# Altium schematic sheet keypad_schematic.SchDoc
size B; SheetNumber: 1; SheetTotal: 1
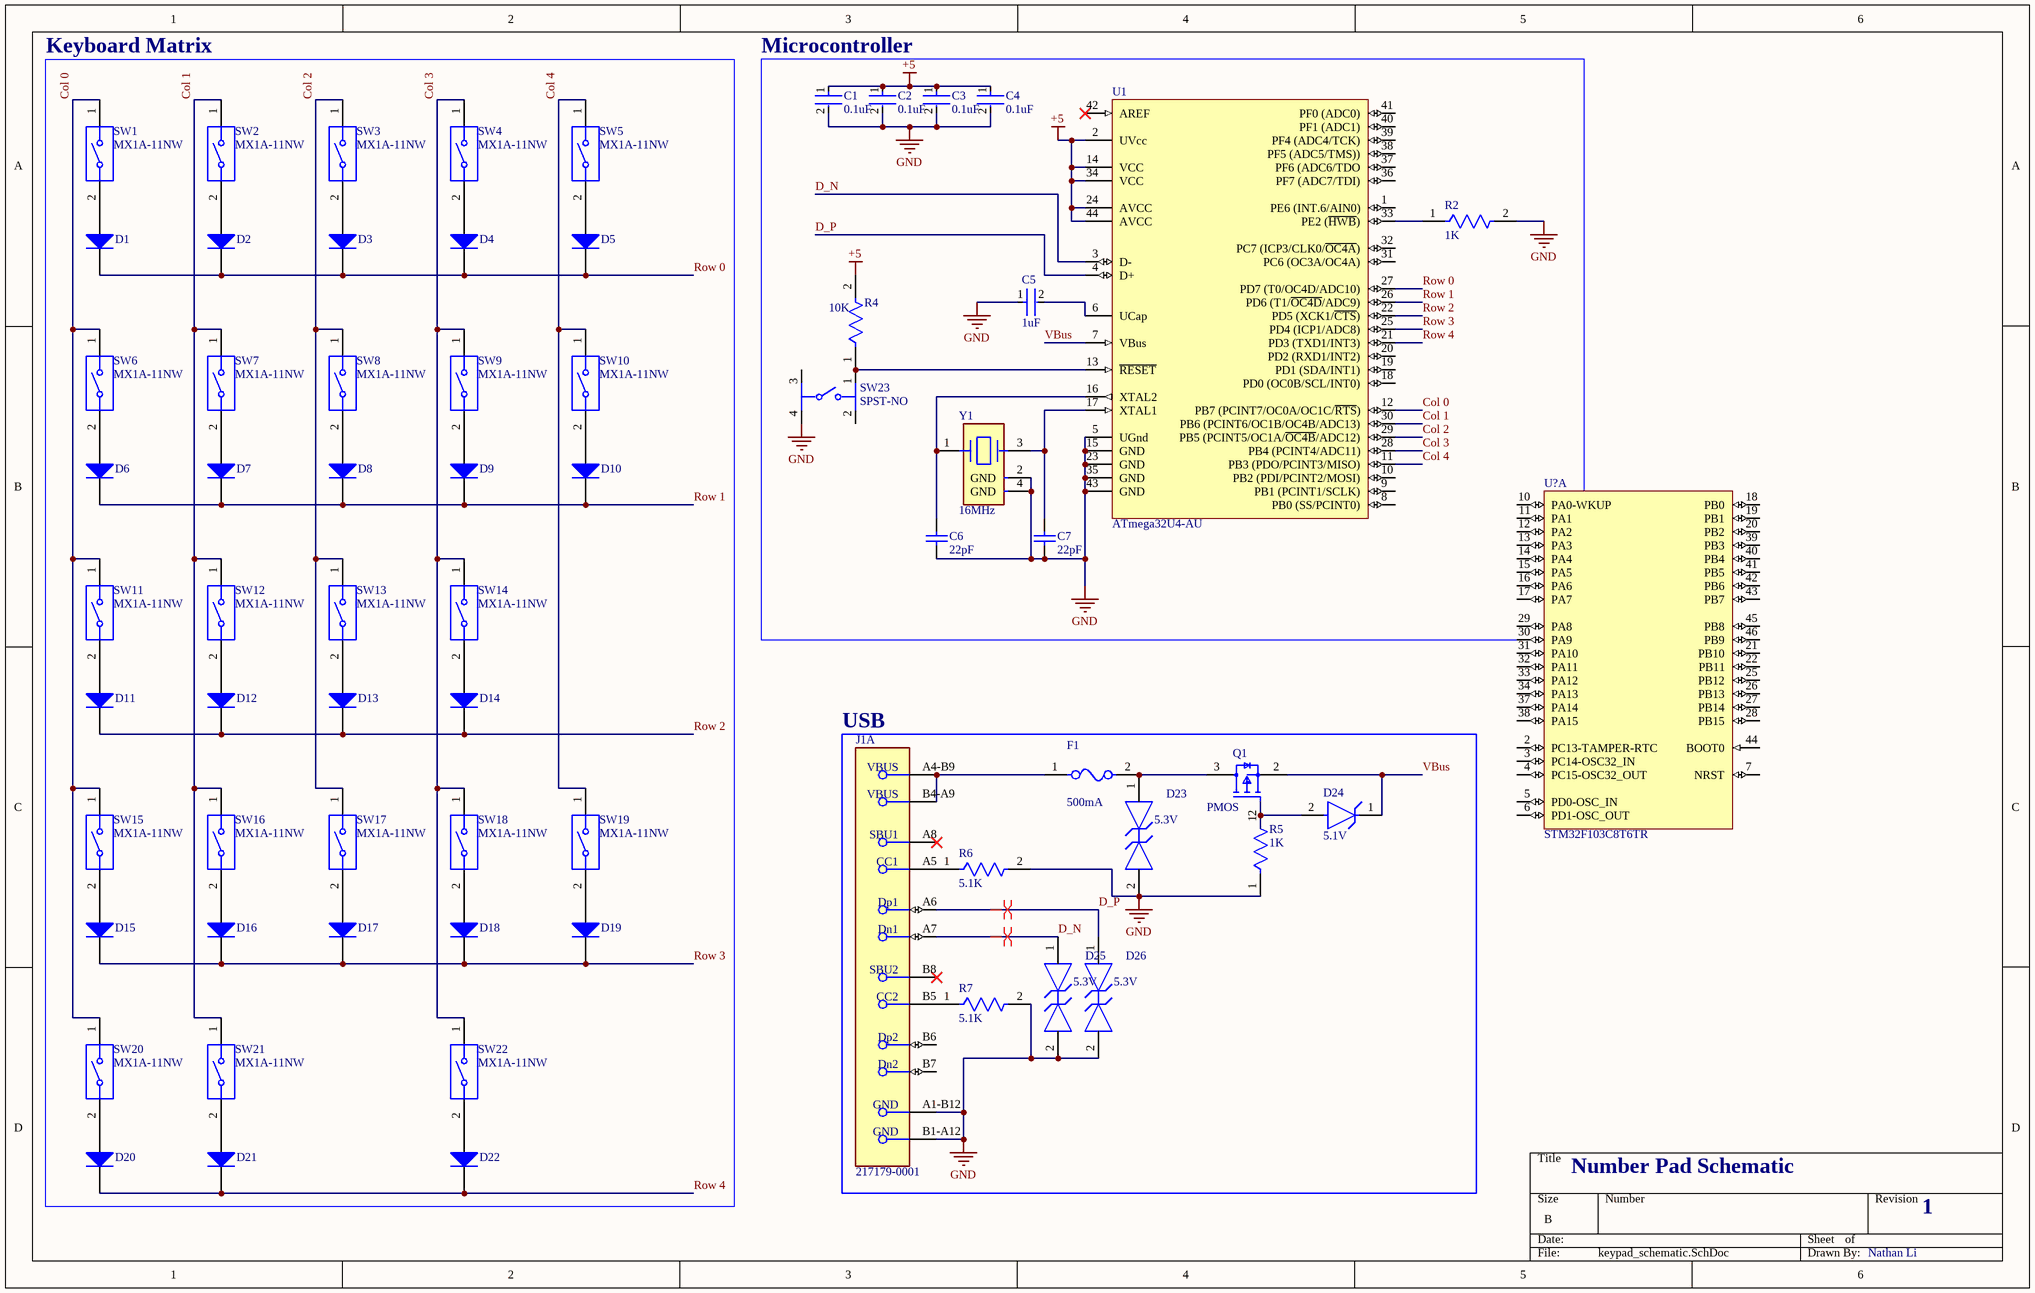
[diagram p0: keypad_schematic.SchDoc]

## Parts
C1  0.1uF  [FP-CL278-IPC_C]
C2  0.1uF  [FP-CL278-IPC_C]
C3  0.1uF  [FP-CL278-IPC_C]
C4  0.1uF  [FP-CL278-IPC_C]
C5  1uF  [FP-CL1016-IPC_C]
C6  22pF  [CAPC1005X55X25NL05T10]
C7  22pF  [CAPC1005X55X25NL05T10]
D1  (no value)  [DIOD-SOD123-2_V]
D2  (no value)  [DIOD-SOD123-2_V]
D3  (no value)  [DIOD-SOD123-2_V]
D4  (no value)  [DIOD-SOD123-2_V]
D5  (no value)  [DIOD-SOD123-2_V]
D6  (no value)  [DIOD-SOD123-2_V]
D7  (no value)  [DIOD-SOD123-2_V]
D8  (no value)  [DIOD-SOD123-2_V]
D9  (no value)  [DIOD-SOD123-2_V]
D10  (no value)  [DIOD-SOD123-2_V]
D11  (no value)  [DIOD-SOD123-2_V]
D12  (no value)  [DIOD-SOD123-2_V]
D13  (no value)  [DIOD-SOD123-2_V]
D14  (no value)  [DIOD-SOD123-2_V]
D15  (no value)  [DIOD-SOD123-2_V]
D16  (no value)  [DIOD-SOD123-2_V]
D17  (no value)  [DIOD-SOD123-2_V]
D18  (no value)  [DIOD-SOD123-2_V]
D19  (no value)  [DIOD-SOD123-2_V]
D20  (no value)  [DIOD-SOD123-2_V]
D21  (no value)  [DIOD-SOD123-2_V]
D22  (no value)  [DIOD-SOD123-2_V]
D23  5.3V  [FP-714AB-MFG]
D24  5.1V  [FP-SOD123-MFG]
D25  5.3V  [FP-714AB-MFG]
D26  5.3V  [FP-714AB-MFG]
F1  500mA  [FP-SF-1206S-MFG]
J1  217179-0001  [FP-2171790001-MFG]  (part A of 2)
Q1  PMOS  [FP-SOT23-MFG]
R2  1K  [FP-RMCF0603-MFG]
R4  10K  [FP-RMCF0603-MFG]
R5  1K  [FP-RMCF0603-MFG]
R6  5.1K  [FP-RG1608-IPC_C]
R7  5.1K  [FP-RG1608-IPC_C]
SW1  MX1A-11NW  [CHRY-MX1A-11NW_V]
SW2  MX1A-11NW  [CHRY-MX1A-11NW_V]
SW3  MX1A-11NW  [CHRY-MX1A-11NW_V]
SW4  MX1A-11NW  [CHRY-MX1A-11NW_V]
SW5  MX1A-11NW  [CHRY-MX1A-11NW_V]
SW6  MX1A-11NW  [CHRY-MX1A-11NW_V]
SW7  MX1A-11NW  [CHRY-MX1A-11NW_V]
SW8  MX1A-11NW  [CHRY-MX1A-11NW_V]
SW9  MX1A-11NW  [CHRY-MX1A-11NW_V]
SW10  MX1A-11NW  [CHRY-MX1A-11NW_V]
SW11  MX1A-11NW  [CHRY-MX1A-11NW_V]
SW12  MX1A-11NW  [CHRY-MX1A-11NW_V]
SW13  MX1A-11NW  [CHRY-MX1A-11NW_V]
SW14  MX1A-11NW  [CHRY-MX1A-11NW_V]
SW15  MX1A-11NW  [CHRY-MX1A-11NW_V]
SW16  MX1A-11NW  [CHRY-MX1A-11NW_V]
SW17  MX1A-11NW  [CHRY-MX1A-11NW_V]
SW18  MX1A-11NW  [CHRY-MX1A-11NW_V]
SW19  MX1A-11NW  [CHRY-MX1A-11NW_V]
SW20  MX1A-11NW  [CHRY-MX1A-11NW_V]
SW21  MX1A-11NW  [CHRY-MX1A-11NW_V]
SW22  MX1A-11NW  [CHRY-MX1A-11NW_V]
SW23  SPST-NO  [FP-PTS647SK38SMTR2LFS-MFG]
U1  ATmega32U4-AU  [44ML_M]
U?  STM32F103C8T6TR  [STM-LQFP48_M]  (part A of 2)
Y1  16MHz  [FP-TSX-3225-MFG]

## Blocks framed on the sheet
Keyboard Matrix: D1-D22 SW1-SW22
Microcontroller: C1-C7 R2 R4 SW23 U1 Y1
USB: D23-D26 F1 J1 Q1 R5-R7

## Nets
+5: C1.1 C2.1 C3.1 C4.1 R4.2 U1.2(UVcc) U1.14(VCC) U1.24(AVCC) U1.34(VCC) U1.44(AVCC)
GND: C1.2 C2.2 C3.2 C4.2 C5.1 C6.1 C7.1 D23.2 D25.2 D26.2 J1.A1-B12(GND) J1.B1-A12(GND) R2.2 R5.1 R6.2 R7.2 SW23.4 U1.5(UGnd) U1.15(GND) U1.23(GND) U1.35(GND) U1.43(GND) Y1.2(GND) Y1.4(GND)
Col 0: SW1.1 SW6.1 SW11.1 SW15.1 SW20.1 U1.12(PB7_(PCINT7/OC0A/OC1C/~{RTS}))
Col 1: SW2.1 SW7.1 SW12.1 SW16.1 SW21.1 U1.30(PB6_(PCINT6/OC1B/OC4B/ADC13))
Col 2: SW3.1 SW8.1 SW13.1 SW17.1 U1.29(PB5_(PCINT5/OC1A/~{OC4B}/ADC12))
Col 3: SW4.1 SW9.1 SW14.1 SW18.1 SW22.1 U1.28(PB4_(PCINT4/ADC11))
Col 4: SW5.1 SW10.1 SW19.1 U1.11(PB3_(PDO/PCINT3/MISO))
D_N: D25.1 J1.A7(Dn1) U1.3(D-)
D_P: D26.1 J1.A6(Dp1) U1.4(D+)
Row 0: D1.2(K) D2.2(K) D3.2(K) D4.2(K) D5.2(K) U1.27(PD7_(T0/OC4D/ADC10))
Row 1: D6.2(K) D7.2(K) D8.2(K) D9.2(K) D10.2(K) U1.26(PD6_(T1/~{OC4D}/ADC9))
Row 2: D11.2(K) D12.2(K) D13.2(K) D14.2(K) U1.22(PD5_(XCK1/~{CTS}))
Row 3: D15.2(K) D16.2(K) D17.2(K) D18.2(K) D19.2(K) U1.25(PD4_(ICP1/ADC8))
Row 4: D20.2(K) D21.2(K) D22.2(K) U1.21(PD3_(TXD1/INT3))
VBus: D24.1(C) Q1.2(S) U1.7(VBus)
NetC5_2: C5.2 U1.6(UCap)
NetC6_2: C6.2 U1.16(XTAL2) Y1.1
NetC7_2: C7.2 U1.17(XTAL1) Y1.3
NetD1_1: D1.1(A) SW1.2
NetD2_1: D2.1(A) SW2.2
NetD3_1: D3.1(A) SW3.2
NetD4_1: D4.1(A) SW4.2
NetD5_1: D5.1(A) SW5.2
NetD6_1: D6.1(A) SW6.2
NetD7_1: D7.1(A) SW7.2
NetD8_1: D8.1(A) SW8.2
NetD9_1: D9.1(A) SW9.2
NetD10_1: D10.1(A) SW10.2
NetD11_1: D11.1(A) SW11.2
NetD12_1: D12.1(A) SW12.2
NetD13_1: D13.1(A) SW13.2
NetD14_1: D14.1(A) SW14.2
NetD15_1: D15.1(A) SW15.2
NetD16_1: D16.1(A) SW16.2
NetD17_1: D17.1(A) SW17.2
NetD18_1: D18.1(A) SW18.2
NetD19_1: D19.1(A) SW19.2
NetD20_1: D20.1(A) SW20.2
NetD21_1: D21.1(A) SW21.2
NetD22_1: D22.1(A) SW22.2
NetD23_1: D23.1 F1.2 Q1.3(D)
NetD24_2: D24.2(A) Q1.1(G) R5.2
NetF1_1: F1.1 J1.A4-B9(VBUS) J1.B4-A9(VBUS)
NetJ1_A5: J1.A5(CC1) R6.1
NetJ1_B5: J1.B5(CC2) R7.1
NetR2_1: R2.1 U1.33(PE2_(~{HWB}))
NetR4_1: R4.1 SW23.1 U1.13(~{RESET})

Not connected (* = marked no-connect by the designer): J1 A8(SBU1)* B6(Dp2) B7(Dn2) B8(SBU2)*; SW23 2 3; U1 1(PE6_(INT.6/AIN0)) 8(PB0_(SS/PCINT0)) 9(PB1_(PCINT1/SCLK)) 10(PB2_(PDI/PCINT2/MOSI)) 18(PD0_(OC0B/SCL/INT0)) 19(PD1_(SDA/INT1)) 20(PD2_(RXD1/INT2)) 31(PC6_(OC3A/OC4A)) 32(PC7_(ICP3/CLK0/~{OC4A})) 36(PF7_(ADC7/TDI)) 37(PF6_(ADC6/TDO) 38(PF5_(ADC5/TMS))) 39(PF4_(ADC4/TCK)) 40(PF1_(ADC1)) 41(PF0_(ADC0)) 42(AREF)*; U? 2(PC13-TAMPER-RTC) 3(PC14-OSC32_IN) 4(PC15-OSC32_OUT) 5(PD0-OSC_IN) 6(PD1-OSC_OUT) 7(NRST) 10(PA0-WKUP) 11(PA1) 12(PA2) 13(PA3) 14(PA4) 15(PA5) 16(PA6) 17(PA7) 18(PB0) 19(PB1) 20(PB2) 21(PB10) 22(PB11) 25(PB12) 26(PB13) 27(PB14) 28(PB15) 29(PA8) 30(PA9) 31(PA10) 32(PA11) 33(PA12) 34(PA13) 37(PA14) 38(PA15) 39(PB3) 40(PB4) 41(PB5) 42(PB6) 43(PB7) 44(BOOT0) 45(PB8) 46(PB9)

## Layout directives
differential pair: D_N, D_P

## Notes on the sheet
- Number Pad Schematic
- 1
- Nathan Li

## Library data of the parts
C1-C4 = CMP-13271-000728-1: Cap Ceramic 100nF 25V X5R ±10% SMD 0402 +85°C Paper T/R; Package Quantity: 1; Height: 0.5mm; Case Code (Metric): 1005; Thickness: 0.022inch; Mount: Surface Mount; Lead Free: Lead Free; Case Code (Imperial): 0402; Packaging: Tape and Reel; Depth: 0.5mm; Voltage: 25V; Min Operating Temperature: -55°C; Voltage Rating: 25V; Dielectric: X5R; Case/Package: 0402; Tolerance: 10%; Width: 0.02inch; Max Operating Temperature: 85°C; Capacitance: 100nF; Length: 1mm; Radiation Hardening: No; Voltage Rating (DC): 25V
C5 = CMP-13271-001946-1: Cap Ceramic 1uF 6.3V X5R ±10% SMD 0402 +85°C Paper T/R; Radiation Hardening: No; Thickness: 0.022inch; Length: 1mm; Voltage Rating: 6.3V; Case Code (Metric): 1005; Voltage: 6.3V; Capacitance: 1uF; Depth: 0.5mm; Min Operating Temperature: -55°C; Height: 0.5mm; Mount: Surface Mount; Case/Package: 0402; Material: Ceramic; Case Code (Imperial): 0402; Lead Free: Lead Free; Width: 0.02inch; Max Operating Temperature: 85°C; Voltage Rating (DC): 6.3V; Tolerance: 10%; Dielectric: X5R; Packaging: Tape and Reel
C6 C7 = CMP-2008-04302-1: Part Number: GRM1555C1H220JA01D; Manufacturer: Murata
D1-D22 = CMP-2000-04932-2: Fast Switching Diode, 100 V, 0.15 A, -65 to 150 degC, 2-Pin?SOD123, RoHS, Tape and Reel; Recovery Time: 4ns; Brand: DiodesIncorporated; Unit Weight: 0.000353oz; Max Surge Current: 2A; Peak Reverse Voltage: 100V; Ir - Reverse Current: 1uA; Vf - Forward Voltage: 1.25V; Configuration: Single; If - Forward Current: 0.15A; Product Category: Diodes-GeneralPurpose,Power,Switching; Operating Temperature Range: -65Cto+150C; Packaging: Reel; Manufacturer URL: http://www.diodes.com/; Maximum Operating Temperature: +150C; Height: 1.25mm; Minimum Operating Temperature: -65C; Product: SwitchingDiodes; Package URL: http://www.diodes.com/datasheets/ds18004.pdf; Type: SwitchingDiode; Package Reference: SOD123-2; Width: 1.7mm; Datasheet URL: http://www.farnell.com/datasheets/1915529.pdf; Datasheet Version: Rev. 24-2, 10/2013; Series: 1N4148; Factory Pack Quantity: 3000; Length: 2.85mm; RoHS: True; Manufacturer: DiodesIncorporated; Mounting Style: SMD/SMT; Package / Case: SOD-123
D23 D25 D26 = CMP-00278-76731233-1: ESD7571N2T5G Esd Protection Device, 5.3V, 0.3W, X2Dfn Rohs Compliant: Yes; Manufacturer Lifecycle Status: ACTIVE; Number of Channels: 1; RoHS: Compliant; NexarPartId: 76731233; Lifecycle Status: Production
D24 = CMP-12792-000005-1: DIODE ZENER 5.1V 500MW SOD123; Manufacturer: Diodes; Manufacturer Part Number: MMSZ5231B-7-F; Standoff Height: 0mm; Max Zener Voltage: 5.36V; Max Reverse Leakage Current: 5uA; Max Junction Temp: +150°C; Power Dissipation: 370mW; Zener Impedance: 17Ω; Temperature: -65°C to +150°C; RoHS: TRUE; ComponentLink2Description: Datasheet; Octopart: https://octopart.com/mmsz5231b-7-f-diodes+inc.-55400050; Height: 1.45mm; ComponentLink2URL: https://www.diodes.com/assets/Datasheets/ds18010.pdf; Footprint Url: https://www.diodes.com/assets/Package-Files/SOD123.pdf; Device Class L2: Diodes; Nom Zener Voltage: 5.1V; Temperature Range Low: -65°C; Mouser Description: Zener Diodes 5.1V 500mW; Digikey Description: DIODE ZENER 5.1V 500MW SOD123; Device Class L1: Discrete Semiconductors; Device Class L3: Zener Diodes; Lead Free: Yes; Category: Diode; Automotive: No; Package: SOD123; Temperature Range High: +150°C
F1 = CMP-07399-000002-1: FUSE BOARD MNT 500MA 63VDC 1206; Manufacturer: Bourns; Manufacturer Part Number: SF-1206S050-2; Fuse Blow Speed: Slow; Voltage Rating: 63V; Value: 596mΩ; Fuse Interrupt Dc Current: 50A; Fuse I2T: 0.03A2Sec; Fuse Current: 0.5A; Digikey Description: FUSE BOARD MNT 500MA 63VDC 1206; ComponentLink2Description: Datasheet; Temperature: -20°C to +105°C; Category: Fuse; Device Class L2: Fuses; Device Class L3: unset; ComponentLink2URL: https://www.bourns.com/docs/product-datasheets/sf-1206s.pdf?sfvrsn=e6b376e3_33; RoHS: TRUE; Package: SF-1206S; Height: 0.7mm; Octopart: https://octopart.com/sf-1206s050-2-bourns-8398336; Ipc Land Pattern Name: CAPC310155X60; Temperature Range Low: -20°C; Lead Free: Yes; Max Fuse Dc Voltage: 63V; Automotive: No; Device Class L1: Circuit Protection; Mouser Description: Fuse Chip Slow Blow Acting 0.5A 63V SMD Solder Pad 1206 T/R UL; Resistance: 596mΩ; Temperature Range High: +105°C
J1 = CMP-04767-000028-2: CONN RCP USB2.0 TYP C 24P SMD RA; NexarPartId: 117190526; Gender: Receptacle; Number of Contacts: 16; Current Rating: 1.25A; Voltage Rating: 30V; Min Operating Temperature: -40°C; USB Standard: USB 2.0; Height: 3.36mm; Contact Material: Gold, Nickel; Max Operating Temperature: 85°C
Q1 = CMP-12801-000021-1: MOSFET P-CH 20V 4.2A SOT23; Manufacturer: Diodes Inc.; Manufacturer Part Number: DMG2305UX-13; Input Capacitace At Vds: 808pF @ -15V; Rthja Max: 90°C/W; Drain To Source Voltage: -20V; Standoff Height: 0.013mm; Number Of P Channels: 1; Gate To Source Voltage: 8V; Turn On Delay Time: 10.8ns; Pulse Drain Current: -15A; Threshold Vgs Max: -0.9V; Max Junction Temp: +150°C; Depletion Mode: False; Drain To Source Resistance: 40mΩ; Threshold Vgs Min: -0.5V; Continuous Drain Current: -4.2A; Turn Off Delay Time: 79.3ns; Gate Charge At Vgs: 10.2nC @ -4.5V; Power Dissipation: 1.4W; Digikey Description: MOSFET P-CH 20V 4.2A SOT23; Temperature Range High: +150°C; Height: 1.1mm; Package: SOT23; Footprint Url: https://www.diodes.com/assets/Package-Files/SOT23.pdf; Device Class L3: MOSFETs; RoHS: TRUE; Temperature: -55°C to +150°C; Mouser Description: MOSFET P-Ch ENH FET -20V 52mOhm -5.0V; Temperature Range Low: -55°C; ComponentLink2Description: Datasheet; Octopart: https://octopart.com/dmg2305ux-13-diodes+inc.-29925594; Ipc Land Pattern Name: SOT92P240X102-3; Device Class L2: Transistors; Automotive: No; Number Of Channels: 1; Drain To Source Breakdown Voltage: -20V; Lead Free: Yes; Device Class L1: Discrete Semiconductors; Category: Trans; ComponentLink2URL: https://www.diodes.com/assets/Datasheets/DMG2305UX.pdf
R2 R5 = CMP-26527-000152-1: 1kΩ ±1% 0.1W 0603 Thick Film Chip Resistor AEC-Q200 compliant; Resistance: 1kR; Max Power Dissipation: 100mW; Temperature Coefficient: 100ppm/°C; Packaging: Tape and Reel; Mount: Surface Mount; RoHS Compliant: Yes; Construction: Rectangular; Width: 0.031inch; Case Code (Imperial): 0603; Contact Plating: Tin; Length: 1.55mm; Lead Free: Lead Free; Case Code (Metric): 1608; Size Code: 0603; Depth: 0.8mm; Series: RMCF; Power Rating: 100mW; Height: 0.022inch; Case/Package: 0603; Tolerance: 1%; Min Operating Temperature: -55°C; Military Standard: Not; Features: Automotive AEC-Q200; Max Operating Temperature: 155°C; Number of Terminations: 2; Radiation Hardening: No; Resistor Type: Thick Film
R4 = CMP-2000-06990-2: 10kΩ ±1% 0.1W 0603 Thick Film Chip Resistor AEC-Q200 compliant; Max Power Dissipation: 100mW; Resistance: 10kR; Temperature Coefficient: 100ppm/°C; Military Standard: Not; Mount: Surface Mount; Depth: 0.8mm; Height: 0.022inch; Size Code: 0603; Case/Package: 0603; Resistor Type: Thick Film; Min Operating Temperature: -55°C; Length: 1.55mm; Construction: Rectangular; Case Code (Imperial): 0603; Packaging: Tape and Reel; Radiation Hardening: No; Power Rating: 100mW; Max Operating Temperature: 155°C; Contact Plating: Tin; Case Code (Metric): 1608; Lead Free: Lead Free; Series: RMCF; Tolerance: 1%; Features: Automotive AEC-Q200; Number of Terminations: 2; RoHS Compliant: Yes; Width: 0.031inch
R6 R7 = CMP-28537-003490-1: Automotive Metal Thin Film Chip Resistor, 0603, 5.1kΩ, 0.1%, 25ppm/°C, 0.1W, 100V; Voltage Rating (DC): 75V; Max Power Dissipation: 100mW; Resistance: 5.1kR; Power Rating: 62.5mW; Lead Free: Lead Free; Number of Terminations: 2; Case/Package: 0603; Case Code (Imperial): 0603; RoHS Compliant: Yes; Temperature Coefficient: 25ppm/°C; Number of Pins: 2; Tolerance: 0.1%; Length: 1.6mm; Height: 0.4mm; Features: Automotive AEC-Q200; Min Operating Temperature: -55°C; Max Operating Temperature: 155°C; Series: RG; Packaging: Tape and Reel; Voltage Rating: 75V; Termination: SMD/SMT; Width: 0.8mm; Case Code (Metric): 1608
SW1-SW22 = CMP-2000-06786-1: Keylock Switch, 12 V, -10 to 70 degC, 2-Pin THD, RoHS, Bulk; Manufacturer: Cherry; Part No: MX1A11NW; Maximum DC Voltage Rating: 12V; COO: UK; Row Spacing: 6.35mm; Pole Throw Configuration: SPST; Total Travel: 4.06mm; Illumination Type: N/R; Actuator Style: Button; Operating Force: 0.58N; Electrical Life: 50000000Cycle; Minimum Insulation Resistance: 100MOhm; Body Orientation: Straight; Actuator Length: 3.6mm; Switch Configuration: N.O.; Maximum Current Rating: 0.01A; Maximum Contact Resistance: 200mOhm; Actuator Color: N/A; Terminal Type: PCPins; Operating Temperature: -10to70C; Number of Terminals: 2; Operating Speed: N/A; Maximum AC Voltage Rating: 12V; Housing Material: N/A; Datasheet URL: https://cdn.sparkfun.com/datasheets/Components/Switches/MX%20Series.pdf; Type: DesktopProfile; Terminal Pitch: 2.54mm; Package Reference: MX1A-11NW; ECCN: EAR99; Family: MX; Packaging: N/A; HTS: 8536509065; Actuator Material: N/A; Package Description: 2-Pin Through Hole Device, Body 15.6 x 15.6 mm; Dielectric Strength: N/A; Illumination Color: N/R; Manufacturer URL: http://cherryswitches.com/cn/; Dimension: 15.6x15.6x15.2mm; Mechanical Life: N/A; RoHS: Unknown; Contact Plating: N/A; Supplier: CherryElectrical; Contact Material: Silver/Gold; IP Rating: N/A; Mounting: ThroughHole; Datasheet Version: 09/2000; Maximum Power Rating: N/A; Mounting Technology: ThroughHole
SW23 = CMP-10040-000033-1: TACT 4.5 X 4.5, 3.8 MM H, 2.5N,; Switch Function: Off-Mom; Switch Travel: 0.25mm; Actuator Type: Standard; Illumination Type: Non-Illuminated; Mechanical Life: 100000Cycles; Ratings: IP40; Operating Force: 250gf; Throw Configuration: SPST; Max Operating Temperature: 70°C; Min Operating Temperature: -20°C; Termination: Gull Wing; Mount: Surface Mount; Packaging: Tape and Reel
U1 = CMP-0095-00285-2: 8-bit AVR Microcontroller, 2.7-5.5V, 16MHz, 32KB Flash, 1KB EEPROM, 2.5KB SRAM, USB Controller, 44-pin TQFP, Industrial Grade (-40°C to 85°C), Ext Osc; RevisionNote: DatasheetVersion updated. URLs added.; ComponentLink1Description: Manufacturer URL; PackageDescription: 44-Pin Plastic Thin Quad Flat Pack, 10 x 10 x 1.0 mm Body, 0.8 mm Pitch (TQFP); DatasheetVersion: revF, Nov-2010; ComponentLink2URL: http://www.atmel.com/dyn/resources/prod_documents/doc7766.pdf; ComponentLink1URL: http://www.atmel.com/; PackageReference: 44ML; ComponentLink2Description: ATmega16U4/32U4 Datasheet; PackageVersion: rev.G, Jul-2007; ComponentLink3URL: http://www.atmel.com/dyn/resources/prod_documents/7766S.pdf; ComponentLink3Description: ATmega16U4 ATmega32U4 Summary
U? = CMP-0237-00216-3: ARM Cortex-M3 32-bit MCU, 64 KB Flash, 20 KB Internal RAM, 37 I/Os, 48-pin LQFP, -40 to 85 degC, Tape and Reel; A/D Converter: 2x12-bit (10 Channel); Internal RAM Size (kB): 20; Supply Voltage(Vcc) min (V): 2; I/Os (High Current): 37; FLASH Size (Prog) (kB): 64; Operating Frequency(F) (Processor speed) (MHz): 72; Packing: Tape and Reel; PackageReference: LQFP48; ComponentLink2Description: Datasheet; Core: ARM Cortex-M3; ComponentLink3URL: http://www.st.com/st-web-ui/static/active/en/resource/technical/document/datasheet/DM00058181.pdf; ComponentLink1Description: Manufacturer URL; ComponentLink3Description: Package Specification; PartNumber: STM32F103C8T6TR; PackageVersion: Rev. 6, 06/2013; ComponentLink2URL: http://www.st.com/st-web-ui/static/active/en/resource/technical/document/datasheet/CD00161566.pdf; PackageDescription: 48-Pin Low Profile Quad Flat Package, 7 x 7 mm Body, 0.5 mm Pitch; Mounting Technology: Surface Mount; DatasheetVersion: Rev. 16; ComponentLink1URL: http://www.st.com/web/en/home.html
Y1 = CMP-36405-000014-1: CRYSTAL 16.0000MHZ 9PF SMD; Tolerance: 10ppm; Drive Level: 200uW; Frequency Stability: 9ppm; ESR (Equivalent Series Resistance): 60R; Min Operating Temperature: -20°C; Packaging: Tape and Reel; Lead Free: Lead Free; Frequency: 16MHz; Mount: Surface Mount; Width: 0.098inch; Length: 0.126inch; Weight: 0.000564oz; Max Operating Temperature: 75°C; Frequency Tolerance: 10ppm; Case/Package: SMD/SMT; Height: 0.024inch; Termination: SMD/SMT; Package Quantity: 1000; Load Capacitance: 9pF; RoHS Compliant: Yes; Series: TSX-3225